# Altium project 18D_radio_test.PrjPcb
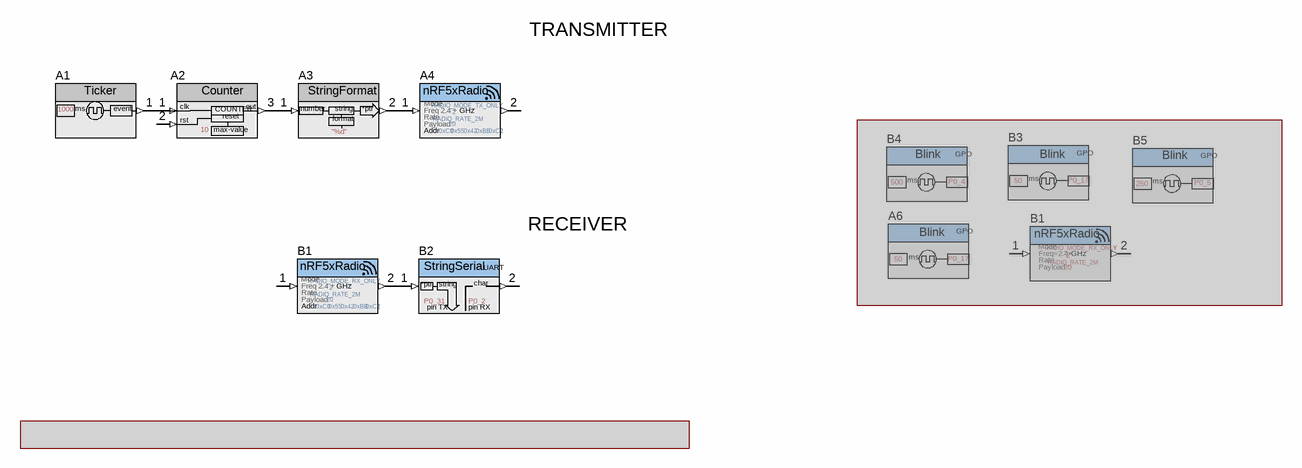
[diagram p0: 18D_radio_test.SchDoc]
OrderQty: 8; prj: 18D_radio_test
1 sheet, 11 parts. Net scope: hierarchical (ports join the sheet entries above them; power ports are global).

## Sheet 18D_radio_test.SchDoc
size A4

### Parts
(Parts that share a designator on the sheet are numbered #1, #2 ... from top to bottom, then left to right.)
A1  Ticker  nBlocksParameter1: 1000
A2  Counter  nBlocksParameter1: 10
A3  StringFormat  nBlocksParameter1: "%d"
A4  nRF5xRadio  nBlocksParameter9: 0xC2  nBlocksParameter8: 0xBB  nBlocksParameter7: 0x42  nBlocksParameter6: 0x55  nBlocksParameter5: 0xC0  nBlocksParameter1: RADIO_MODE_TX_ONLY  nBlocksParameter2: RADIO_RATE_2M  Parameter 2: Rate  Parameter 4: Payload  Parameter 3: Freq 2.4 +  Parameter 1: Mode  nBlocksParameter4: 20  nBlocksParameter3: 2
A6  Blink  nBlocksParameter2: P0_17  nBlocksParameter1: 50  (masked out: inside a compile mask, not in the netlist)
B1#1  nRF5xRadio  nBlocksParameter1: RADIO_MODE_RX_ONLY  nBlocksParameter2: RADIO_RATE_2M  Parameter 2: Rate  Parameter 4: Payload  Parameter 3: Freq=2.4+  Parameter 1: Mode  nBlocksParameter4: 20  nBlocksParameter3: 2  (masked out: inside a compile mask, not in the netlist)
B1#2  nRF5xRadio  nBlocksParameter9: 0xC2  nBlocksParameter8: 0xBB  nBlocksParameter7: 0x42  nBlocksParameter6: 0x55  nBlocksParameter5: 0xC0  nBlocksParameter1: RADIO_MODE_RX_ONLY  nBlocksParameter2: RADIO_RATE_2M  Parameter 2: Rate  Parameter 4: Payload  Parameter 3: Freq 2.4 +  Parameter 1: Mode  nBlocksParameter4: 20  nBlocksParameter3: 2
B2  StringSerial  nBlocksParameter2: P0_2  nBlocksParameter1: P0_31
B3  Blink  nBlocksParameter2: P0_17  nBlocksParameter1: 50  (masked out: inside a compile mask, not in the netlist)
B4  Blink  nBlocksParameter2: P0_4  nBlocksParameter1: 500  (masked out: inside a compile mask, not in the netlist)
B5  Blink  nBlocksParameter2: P0_5  nBlocksParameter1: 250  (masked out: inside a compile mask, not in the netlist)

### Nets
NetA1_1: A1.1(OUT) A2.1(COUNT-IN)
NetA2_3: A2.3(OUT) A3.1(IN)
NetA3_2: A3.2(OUT) A4.1(ValueIn)
NetB1#2_2: B1#2.2(ValueOut) B2.1(TX)

Not connected (* = marked no-connect by the designer): A2 2(RESET); A4 2(ValueOut); B1#2 1(ValueIn); B2 2(RX)

### Notes on the sheet
- TRANSMITTER
- RECEIVER
- (in symbol NODE-BLINK) GPO; ms
- (in symbol NODE-COUNTER) clk; out; COUNTER; rst; reset; max-value
- (in symbol NODE-nRF5xRadio) GHz; Addr
- (in symbol NODE-STRINGFORMAT) number; string; *ptr; format
- (in symbol NODE-STRINGSERIAL) UART; *ptr; string; char; pin TX; pin RX
- (in symbol NODE-TICKER) ms; event

### Library data of the parts
A1 = NODE-TICKER: Creates a Periodical Event; ComponentLink1Description: link; ComponentLink1URL: https://github.com/nBlocksStudioNodes/nblocks_ticker
A2 = NODE-COUNTER: Ressetable Counter. Returns to zero, when max-value is reached; Parameter 1: AutoResetValue; ComponentLink1Description: link; ComponentLink1URL: https://github.com/nBlocksStudioNodes/nblocks_counter
A3 = NODE-STRINGFORMAT: Parameter 1: formatString; ComponentLink1Description: link; ComponentLink1URL: https://github.com/nBlocksStudioNodes/nblocks_stringformat
A4 B1#2 = NODE-nRF5xRadio: # nRF5xRadio / 2.4 GHz Radio Node for Nordic protocol on nRF5x SoC, like nRF52832 / Nine (9) Parameters: / *  Mode:  RADIO_MODE_TX_ONLY, RADIO_MODE_RX_ONLY / *  Freq: Offset 0 to 99 in 1MHz steps added to base 2.4 GHz / *  Rate: RADIO_RATE_2M, RADIO_RATE_1M, RADIO_RATE_250K / *  Payload: max 32 / *  Address: 5 x Bytes in HEX form 0xC0… /; Parameter 5: Address0; Parameter 6: Address1; Parameter 7: Address2; Parameter 8: Address3; Parameter 9: Address4; ComponentLink1Description: link; ComponentLink1URL: https://github.com/nBlocksStudioNodes/nblocks_nrf5xradio
A6 B3-B5 = NODE-BLINK: Blink Node. Can be used for LED blinking or GPIO pulsing; Parameter 2: pinOut; Parameter 1: period(ms); ComponentLink1Description: link; ComponentLink1URL: https://github.com/nBlocksStudioNodes/nblocks_blink
B1#1 = NODE-nRF5xRadio: # nRF51xRadio / Bare metal nRF5x Radio Node / PARAMETERS total 9: / *  Mode 0=TX, 1=RX, 2=RxTx, / *  Rate: 2=250k, 1=1M,  0=2M , payload max 32 / *  Freq_offset 0 to 100 (is in 1MHz steps added to base 2.400GHz) / *  Payload max 32 / *  5 address parameters in HEX form 0x55...; Parameter 5: Address0; Parameter 6: Address1; Parameter 7: Address2; Parameter 8: Address3; Parameter 9: Address4; nBlocksParameter9: 0xC2; nBlocksParameter8: 0xBB; nBlocksParameter7: 0x42; nBlocksParameter6: 0x55; nBlocksParameter5: 0xC0; ComponentLink1Description: link; ComponentLink1URL: https://github.com/nBlocksStudioNodes/nblocks_nrf5xradio
B2 = NODE-STRINGSERIAL: This node implements a serial port, where characters received from the external world (RX pin) are sent one by one to the node's output, but the node's input expects a full string object as input (sent entirely within one frame to the TX pin). / DO NOT CONNECT integer data into this node, as it will definitely lead to incorrect behaviour, sending random bytes in unpredicted amount to the serial port. This can be harmful depending on your design.; Parameter 2: pinRX; Parameter 1: pinTX; ComponentLink1Description: link; ComponentLink1URL: https://github.com/nBlocksStudioNodes/nblocks_stringserial